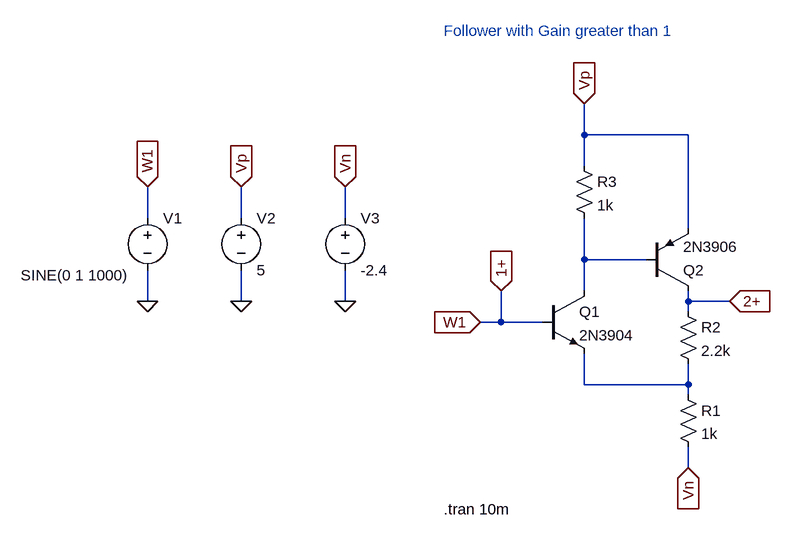
[diagram p0: schematic flw_gain_gr_one_ltspice.asc]
flw_gain_gr_one_ltspice.asc, the LTspice schematic file:
Version 4
SHEET 1 916 680
WIRE 96 -256 96 -304
WIRE 256 -256 96 -256
WIRE 96 -208 96 -256
WIRE -576 -128 -576 -176
WIRE -432 -128 -432 -176
WIRE -272 -128 -272 -176
WIRE 256 -112 256 -256
WIRE 96 -64 96 -128
WIRE 192 -64 96 -64
WIRE 96 -16 96 -64
WIRE -576 0 -576 -48
WIRE -432 0 -432 -48
WIRE -272 0 -272 -48
WIRE 256 0 256 -16
WIRE 320 0 256 0
WIRE 256 16 256 0
WIRE -32 32 -32 -16
WIRE -32 32 -64 32
WIRE 32 32 -32 32
WIRE 96 128 96 80
WIRE 256 128 256 96
WIRE 256 128 96 128
WIRE 256 144 256 128
WIRE 256 256 256 224
FLAG -576 0 0
FLAG -432 0 0
FLAG -272 0 0
FLAG -576 -176 W1
IOPIN -576 -176 In
FLAG -432 -176 Vp
IOPIN -432 -176 In
FLAG -272 -176 Vn
IOPIN -272 -176 In
FLAG -64 32 W1
IOPIN -64 32 In
FLAG 96 -304 Vp
IOPIN 96 -304 In
FLAG 256 256 Vn
IOPIN 256 256 In
FLAG -32 -16 1+
IOPIN -32 -16 In
FLAG 320 0 2+
IOPIN 320 0 In
SYMBOL voltage -576 -144 R0
WINDOW 3 -195 104 Left 2
WINDOW 123 0 0 Left 0
WINDOW 39 0 0 Left 0
SYMATTR Value SINE(0 1 1000)
SYMATTR InstName V1
SYMBOL voltage -432 -144 R0
WINDOW 123 0 0 Left 0
WINDOW 39 0 0 Left 0
SYMATTR InstName V2
SYMATTR Value 5
SYMBOL voltage -272 -144 R0
WINDOW 123 0 0 Left 0
WINDOW 39 0 0 Left 0
SYMATTR InstName V3
SYMATTR Value -2.4
SYMBOL npn 32 -16 R0
SYMATTR InstName Q1
SYMATTR Value 2N3904
SYMBOL pnp 192 -16 M180
SYMATTR InstName Q2
SYMATTR Value 2N3906
SYMBOL res 240 128 R0
SYMATTR InstName R1
SYMATTR Value 1k
SYMBOL res 240 0 R0
SYMATTR InstName R2
SYMATTR Value 2.2k
SYMBOL res 80 -224 R0
SYMATTR InstName R3
SYMATTR Value 1k
TEXT -120 320 Left 2 !.tran 10m
TEXT -120 -416 Left 2 ;Follower with Gain greater than 1

The netlist it stands for:
* flw_gain_gr_one_ltspice.asc
V1 1+ 0 SINE(0 1 1000)
V2 Vp 0 5
V3 Vn 0 -2.4
Q1 N001 1+ N002 0 2N3904
Q2 2+ N001 Vp 0 2N3906
R1 N002 Vn 1k
R2 2+ N002 2.2k
R3 Vp N001 1k
.model NPN NPN
.model PNP PNP
.lib standard.bjt
.tran 10m
* Follower with Gain greater than 1
.backanno
.end